# EAGLE design kapal2 (EAGLE 7.6.0)
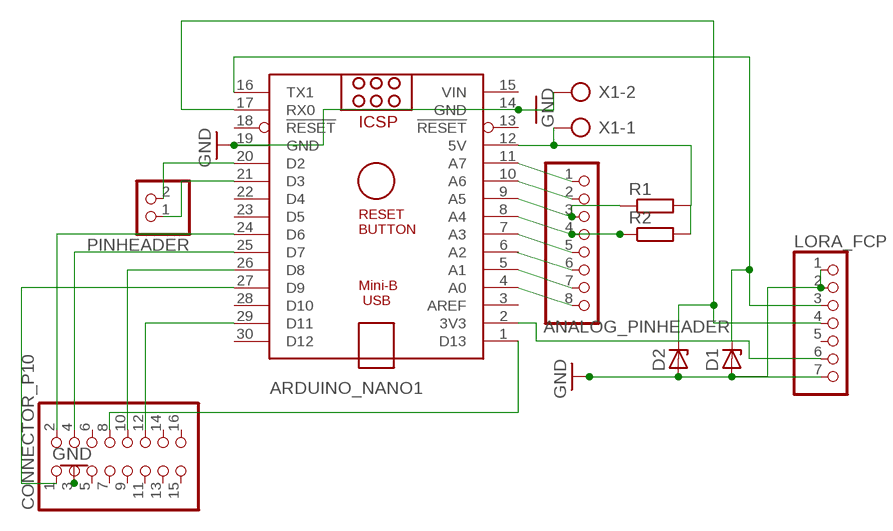
[diagram p0: schematic, sheet 1]

## Parts
ANALOG_PINHEADER  PINHD-1X8  [1X08]
ARDUINO_NANO1  ARDUINO_NANO  [ARDUINO_NANO]
CONNECTOR_P10  PINHD-2X8  [2X08]
D1  ZENER-DIODEDO35Z10  [DO35Z10]
D2  ZENER-DIODEDO35Z10  [DO35Z10]
LORA_FCP  PINHD-1X7  [1X07]
PINHEADER  PINHD-1X2  [1X02]
R1  R-EU_0204/7  [0204/7]
R2  R-EU_0204/7  [0204/7]
X1  AK300/2  [AK300/2]

## Nets
D7: ARDUINO_NANO1.25(D7) CONNECTOR_P10.4
D13: ARDUINO_NANO1.1(D13) CONNECTOR_P10.8
GND: ARDUINO_NANO1.14(GND) ARDUINO_NANO1.19(GND) CONNECTOR_P10.3 D1.A D2.A LORA_FCP.1 LORA_FCP.2 LORA_FCP.7 X1.2
N$1: ARDUINO_NANO1.27(D9) CONNECTOR_P10.1
N$2: ARDUINO_NANO1.16(TX1) D1.C LORA_FCP.3
N$3: ARDUINO_NANO1.24(D6) CONNECTOR_P10.2
N$4: ARDUINO_NANO1.26(D8) CONNECTOR_P10.10
N$5: ARDUINO_NANO1.29(D11) CONNECTOR_P10.12
N$6: ANALOG_PINHEADER.3 ARDUINO_NANO1.9(A5) R1.1
N$8: ARDUINO_NANO1.12(5V) R1.2 R2.2 X1.1
N$14: ARDUINO_NANO1.17(RX0) D2.C LORA_FCP.4
N$15: ARDUINO_NANO1.20(D2) PINHEADER.2
N$16: ARDUINO_NANO1.2(3V3) LORA_FCP.6
N$17: ARDUINO_NANO1.21(D3) PINHEADER.1
N$18: ANALOG_PINHEADER.1 ARDUINO_NANO1.11(A7)
N$19: ANALOG_PINHEADER.2 ARDUINO_NANO1.10(A6)
N$21: ANALOG_PINHEADER.4 ARDUINO_NANO1.8(A4) R2.1
N$22: ANALOG_PINHEADER.5 ARDUINO_NANO1.7(A3)
N$23: ANALOG_PINHEADER.6
N$24: ANALOG_PINHEADER.7 ARDUINO_NANO1.5(A1)
N$25: ANALOG_PINHEADER.8 ARDUINO_NANO1.4(A0)
Unconnected: ARDUINO_NANO1.3(AREF) ARDUINO_NANO1.6(A2) ARDUINO_NANO1.13(!RESET) ARDUINO_NANO1.18(!RESET) ARDUINO_NANO1.22(D4) ARDUINO_NANO1.23(D5) ARDUINO_NANO1.28(D10) ARDUINO_NANO1.30(D12) CONNECTOR_P10.5 CONNECTOR_P10.6 CONNECTOR_P10.7 CONNECTOR_P10.9 CONNECTOR_P10.11 CONNECTOR_P10.13 CONNECTOR_P10.14 CONNECTOR_P10.15 CONNECTOR_P10.16 LORA_FCP.5

## Power pins joined to a net without a drawn wire
VIN: ARDUINO_NANO1.15(VIN)

## Library data of the parts
ANALOG_PINHEADER = pinhead:PINHD-1X8: PIN HEADER
ARDUINO_NANO1 = ArduinoNanoV30:ARDUINO_NANO: Arduino Nano V3.0 Overview: The Arduino Nano is a small, complete, and breadboard-friendly board based on the ATmega328 (Arduino Nano 3.x) or ATmega168 (Arduino Nano 2.x). It has more or less the same functionality of the Arduino Duemilanove, but in a different package. It lacks only a DC power jack, and works with a Mini-B USB cable instead of a standard one. The Nano was designed and is being produced by Gravitech. Specifications: Microcontroller Atmel ATmega168 or ATmega328 Operating Voltage (logic level) 5 V Input Voltage (recommended) 7-12 V Input Voltage (limits) 6-20 V Digital I/O Pins 14 (of which 6 provide PWM output) Analog Input Pins 8 DC Current per I/O Pin 40 mA Flash Memory 16 KB (ATmega168) or 32 KB (ATmega328) of which 2 KB used by bootloader SRAM 1 KB (ATmega168) or 2 KB (ATmega328) EEPROM 512 bytes (ATmega168) or 1 KB (ATmega328) Clock Speed 16 MHz Dimensions 0.73" x 1.70" Length 45 mm Width 18 mm Weigth 5 g Power: The Arduino Nano can be powered via the Mini-B USB connection, 6-20V unregulated external power supply (pin 30), or 5V regulated external power supply (pin 27). The power source is automatically selected to the highest voltage source. Memory: The ATmega168 has 16 KB of flash memory for storing code (of which 2 KB is used for the bootloader); the ATmega328 has 32 KB, (also with 2 KB used for the bootloader). The ATmega168 has 1 KB of SRAM and 512 bytes of EEPROM (which can be read and written with the EEPROM library); the ATmega328 has 2 KB of SRAM and 1 KB of EEPROM. Input and Output: Each of the 14 digital pins on the Nano can be used as an input or output, using pinMode(), digitalWrite(), and digitalRead() functions. They operate at 5 volts. Each pin can provide or receive a maximum of 40 mA and has an internal pull-up resistor (disconnected by default) of 20-50 kOhms. In addition, some pins have specialized functions. Visit Arduino - ArduinoBoardNano <https://www.arduino.cc/en/Main/ArduinoBoardNano>
CONNECTOR_P10 = pinhead:PINHD-2X8: PIN HEADER
D1 D2 = diode:ZENER-DIODE: Z-Diode
LORA_FCP = pinhead:PINHD-1X7: PIN HEADER
PINHEADER = pinhead:PINHD-1X2: PIN HEADER
R1 R2 = resistor:R-EU_: RESISTOR, European symbol
X1 = con-ptr500:AK300/2: CONNECTOR; OC_FARNELL: unknown; OC_NEWARK: unknown

## Board
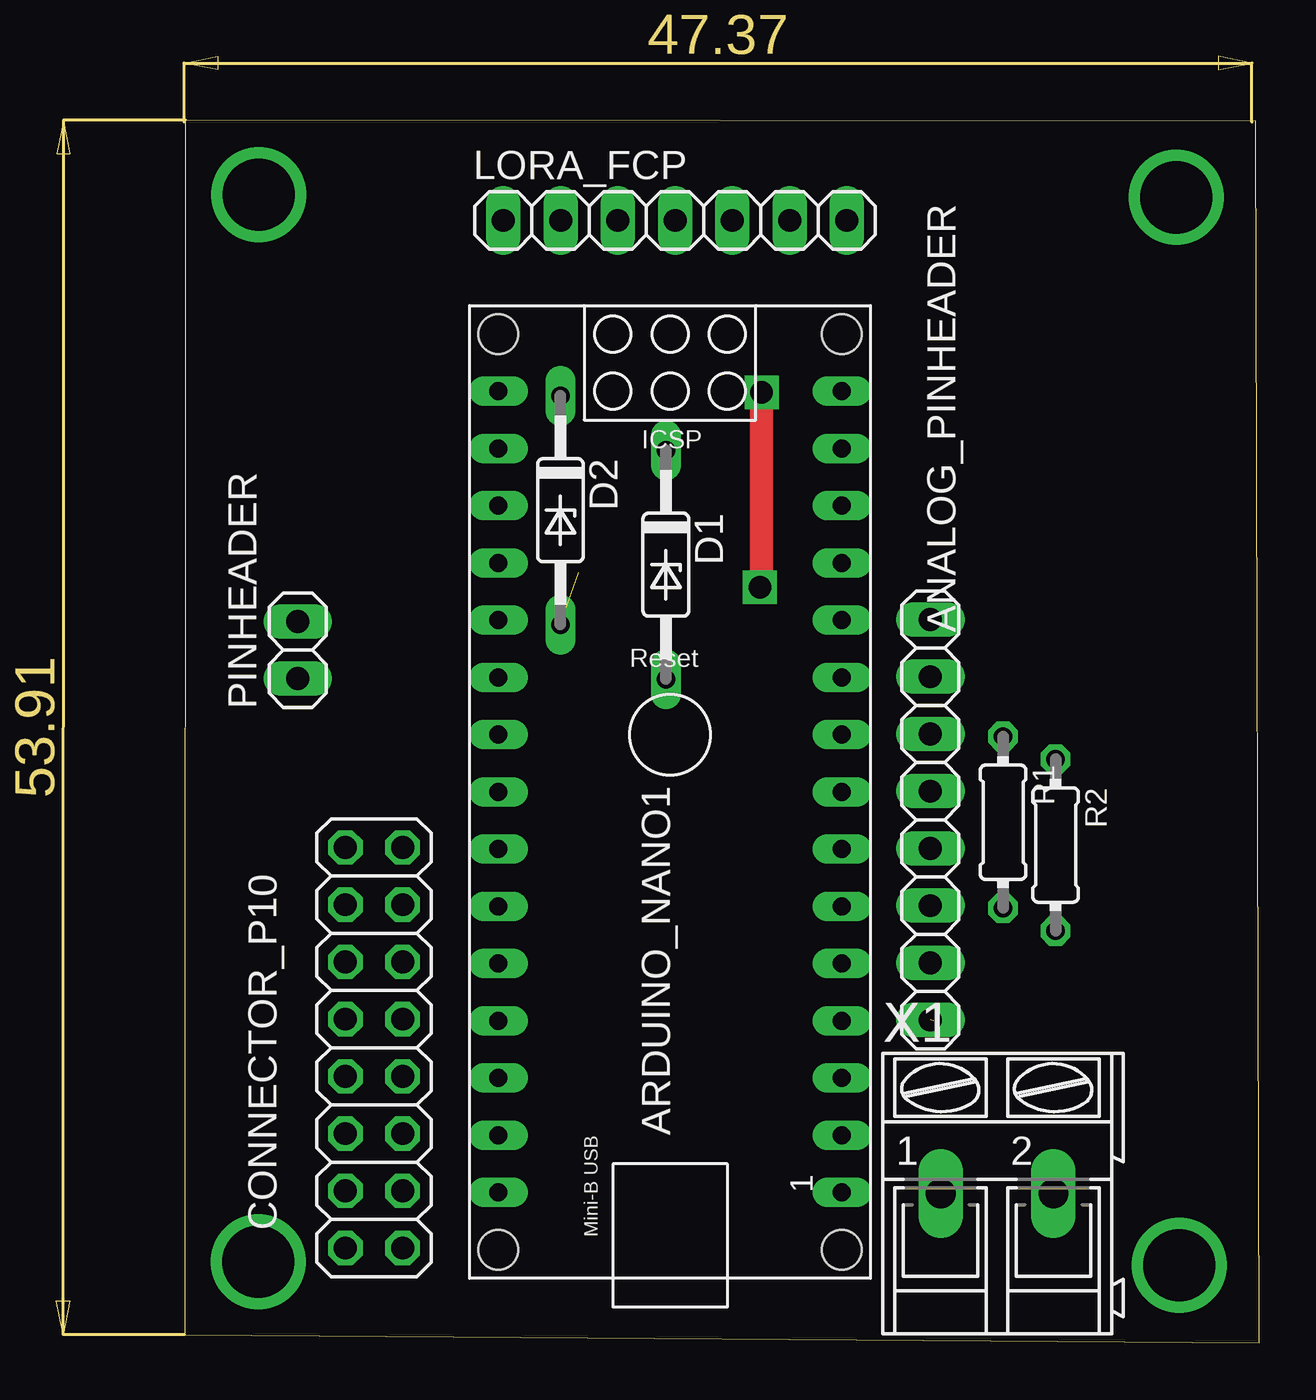
[diagram p1: board, top side]
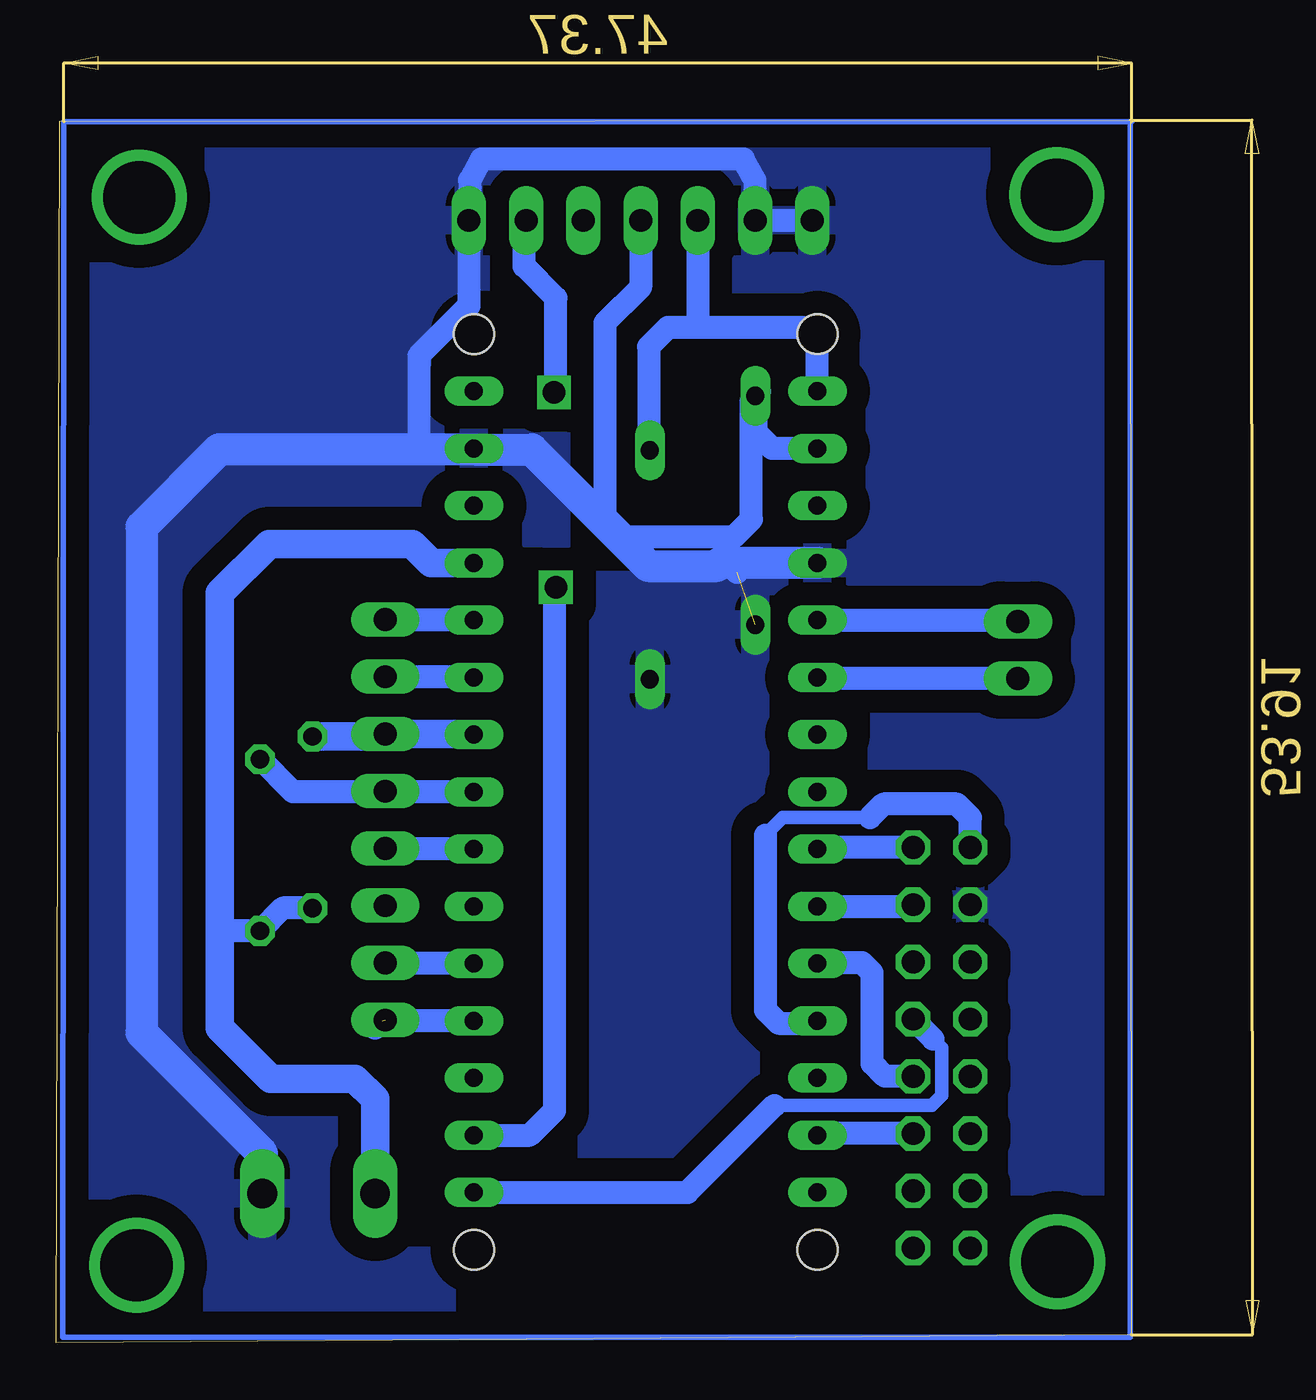
[diagram p2: board, bottom side, seen from below]

Size 47.68 x 54.26 mm. Coordinates in mm from the lower left corner, seen from the top.
Outline: 0,0.36 47.68,0 47.53,54.22 0.03,54.26 0,0.36
Copper layers (1*16): Top 0.035mm / dielectric 1.5mm / Bottom 0.035mm
Design rules "default": minimum track width 10mil, minimum drill 24mil, track to track 8mil, track to pad 8mil, pad to pad 8mil, via to via 8mil, smd to smd 8mil, copper to edge 40mil, drill to drill 8mil, minimum pad ring 10mil, minimum via ring 8mil, stop-mask expansion 4mil, vias tented up to drill 0mil, thermal gap 10mil

### Footprints (pad centres in the part's own frame; a part is rotated, then mirrored left to right if it is on the bottom)
1X08 = drill 1.016 long: 1 -8.89,0; 2 -6.35,0; 3 -3.81,0; 4 -1.27,0; 5 1.27,0; 6 3.81,0; 7 6.35,0; 8 8.89,0
ARDUINO_NANO = drill 0.8 long: 1 -20.32,-7.62; 2 -17.78,-7.62; 3 -15.24,-7.62; 4 -12.7,-7.62; 5 -10.16,-7.62; 6 -7.62,-7.62; 7 -5.08,-7.62; 8 -2.54,-7.62; 9 0,-7.62; 10 2.54,-7.62; 11 5.08,-7.62; 12 7.62,-7.62; 13 10.16,-7.62; 14 12.7,-7.62; 15 15.24,-7.62; 16 15.24,7.62; 17 12.7,7.62; 18 10.16,7.62; 19 7.62,7.62; 20 5.08,7.62; 21 2.54,7.62; 22 0,7.62; 23 -2.54,7.62; 24 -5.08,7.62; 25 -7.62,7.62; 26 -10.16,7.62; 27 -12.7,7.62; 28 -15.24,7.62; 29 -17.78,7.62; 30 -20.32,7.62 | hole 1.778: -22.86,-7.62; -22.86,7.62; 17.78,7.62; 17.78,-7.62
2X08 = drill 1.016 octagon: 1 -8.89,-1.27; 2 -8.89,1.27; 3 -6.35,-1.27; 4 -6.35,1.27; 5 -3.81,-1.27; 6 -3.81,1.27; 7 -1.27,-1.27; 8 -1.27,1.27; 9 1.27,-1.27; 10 1.27,1.27; 11 3.81,-1.27; 12 3.81,1.27; 13 6.35,-1.27; 14 6.35,1.27; 15 8.89,-1.27; 16 8.89,1.27
DO35Z10 = drill 0.813 long: A 5.08,0; C -5.08,0
1X07 = drill 1.016 long: 1 -7.62,0; 2 -5.08,0; 3 -2.54,0; 4 0,0; 5 2.54,0; 6 5.08,0; 7 7.62,0
1X02 = drill 1.016 long: 1 -1.27,0; 2 1.27,0
0204/7 = drill 0.813 octagon: 1 -3.81,0; 2 3.81,0
AK300/2 = drill 1.321 long: 1 -2.515,0; 2 2.489,0

### Placement (x,y rotation side)
ANALOG_PINHEADER  33.09,23.21 270 top
ARDUINO_NANO1  21.54,26.98 90 top
CONNECTOR_P10  8.4,13.09 270 top
D1  21.35,34.53 270 top
D2  16.67,36.95 270 top
LORA_FCP  21.76,49.81 0 top
PINHEADER  5.02,30.74 90 top
R1  36.31,23.1 270 top
R2  38.64,22.09 270 top
X1  36.06,6.62 0 top

### Tracks (layer width: path | path; a pad name or v marks a point on that pad's centre or on a via)
D7
  Bottom 1.016: ARDUINO_NANO1.25 9.75,19.37 CONNECTOR_P10.4
D13
  Bottom 0.61: 15.82,10.53 8.84,10.53 8.39,10.98 8.39,13.08 8.79,13.47
  Bottom 1.016: ARDUINO_NANO1.1 19.68,6.67 15.82,10.53 | 8.79,13.47 8.79,13.48 CONNECTOR_P10.8
GND  (1 unrouted)
  Bottom 1.016: 29.11,39.64 ARDUINO_NANO1.14 | LORA_FCP.1 LORA_FCP.2 16.68,51.57 17.2,52.54 28.83,52.54 29.35,51.58 29.35,49.85 LORA_FCP.7 | 17.48,34.18 17.9,34.6 | 31.4,39.64 31.6,39.84 31.6,43.8 29.38,46.02 LORA_FCP.7 | 29.32,49.88 LORA_FCP.7
  Bottom 1.422: ARDUINO_NANO1.19 17.9,34.6 18.24,34.6 18.37,34.48 21.42,34.48 26.59,39.64 29.11,39.64 31.4,39.64 40.47,39.64 43.9,36.21 43.9,13.75 38.55,8.4 X1.2
  pour Bottom (isolate 1.016): -0.36,54.02 47.66,54.02 47.66,0.05 -0.25,0.05 -0.25,53.91
N$1
  Bottom 0.61: 11.58,23.31 15.44,23.31 16.22,22.53
  Bottom 1.016: CONNECTOR_P10.1 7.13,23.31 7.73,23.9 10.99,23.9 11.58,23.31 | 16.22,22.53 16.22,14.76 15.64,14.18 14.02,14.18 ARDUINO_NANO1.27
N$2
  Bottom 1.016: 21.28,39.68 D1.C 21.41,39.67 21.41,44.2 20.55,45.06 19.28,45.06 | ARDUINO_NANO1.16 13.92,44.39 14.58,45.06 19.28,45.06 | LORA_FCP.3 19.22,45.12 19.28,45.06
N$3
  Bottom 1.016: CONNECTOR_P10.2 13.84,21.98 ARDUINO_NANO1.24
N$4
  Bottom 1.016: CONNECTOR_P10.10 10.92,11.82 11.48,12.39 11.48,16.41 11.93,16.86 13.88,16.86 ARDUINO_NANO1.26
N$5
  Bottom 1.016: CONNECTOR_P10.12 13.84,9.28 ARDUINO_NANO1.29
N$6
  Bottom 1.016: 33.2,26.91 ANALOG_PINHEADER.3 | 29.19,27.02 ARDUINO_NANO1.9
  Bottom 1.27: 29.19,27.02 ANALOG_PINHEADER.3 | 33.2,26.91 R1.1
N$8
  Bottom 1.016: R1.2 37.63,19.29 R2.2 40.41,18.28 40.43,18.29
  Bottom 1.27: ARDUINO_NANO1.12 31.04,34.6 31.89,35.45 38.25,35.45 40.43,33.27 40.43,18.29 40.43,13.97 38.17,11.71 34.44,11.71 33.53,10.81 33.53,6.63 X1.1 33.58,6.66
N$9  (via drill 3.2 pad 1.68)
  other vias: 44,50.83
N$10
  Bottom 0.254: -0.02,54.18 47.35,54.18 47.4,0.23 0.03,0.23 0.03,47.99
N$11  (via drill 3.2 pad 1.68)
  other vias: 44.12,3.44
N$12  (via drill 3.2 pad 1.68)
  other vias: 3.29,50.96
N$13  (via drill 3.2 pad 1.68)
  other vias: 3.26,3.6
N$14
  Bottom 1.016: 16.48,42.22 D2.C | ARDUINO_NANO1.17 15.92,39.68 16.63,40.4 16.63,41.99 D2.C | LORA_FCP.4 21.76,46.84 23.34,45.27 23.34,36.36 22.76,35.77 17.61,35.77 16.85,36.53 16.85,41.86 D2.C
N$15
  Bottom 1.016: ARDUINO_NANO1.20 5.07,32.06 PINHEADER.2
N$16  (via drill 1)
  Top 1.016: v25.52,33.53 25.54,33.53 25.6,33.59 v25.6,42.18
  Bottom 1.016: ARDUINO_NANO1.2 26.68,9.21 25.58,10.31 25.58,33.47 v25.52,33.53 | v25.6,42.18 25.52,42.18 25.52,46.36 26.92,47.77 26.92,49.73 LORA_FCP.6
N$17
  Bottom 1.016: PINHEADER.1 13.86,29.47 ARDUINO_NANO1.21
N$18
  Bottom 1.016: ARDUINO_NANO1.11 33.05,32.06 ANALOG_PINHEADER.1
N$19
  Bottom 1.016: ANALOG_PINHEADER.2 29.19,29.56 ARDUINO_NANO1.10
N$21
  Bottom 1.016: ANALOG_PINHEADER.4 33.05,24.45 ARDUINO_NANO1.8 37.19,24.45 R2.1
N$22
  Bottom 1.016: ANALOG_PINHEADER.5 29.19,21.94 ARDUINO_NANO1.7
N$23
  Bottom 1.016: 33.05,19.37 ANALOG_PINHEADER.6
N$24
  Bottom 1.016: ANALOG_PINHEADER.7 29.19,16.86 ARDUINO_NANO1.5
N$25  (1 unrouted)
  Bottom 1.016: ARDUINO_NANO1.4 33.23,14.29 33.55,13.96
N$26
  Bottom 0.254: 0.04,47.99 0.04,54.18